# EAGLE design working (EAGLE 7.5.0)
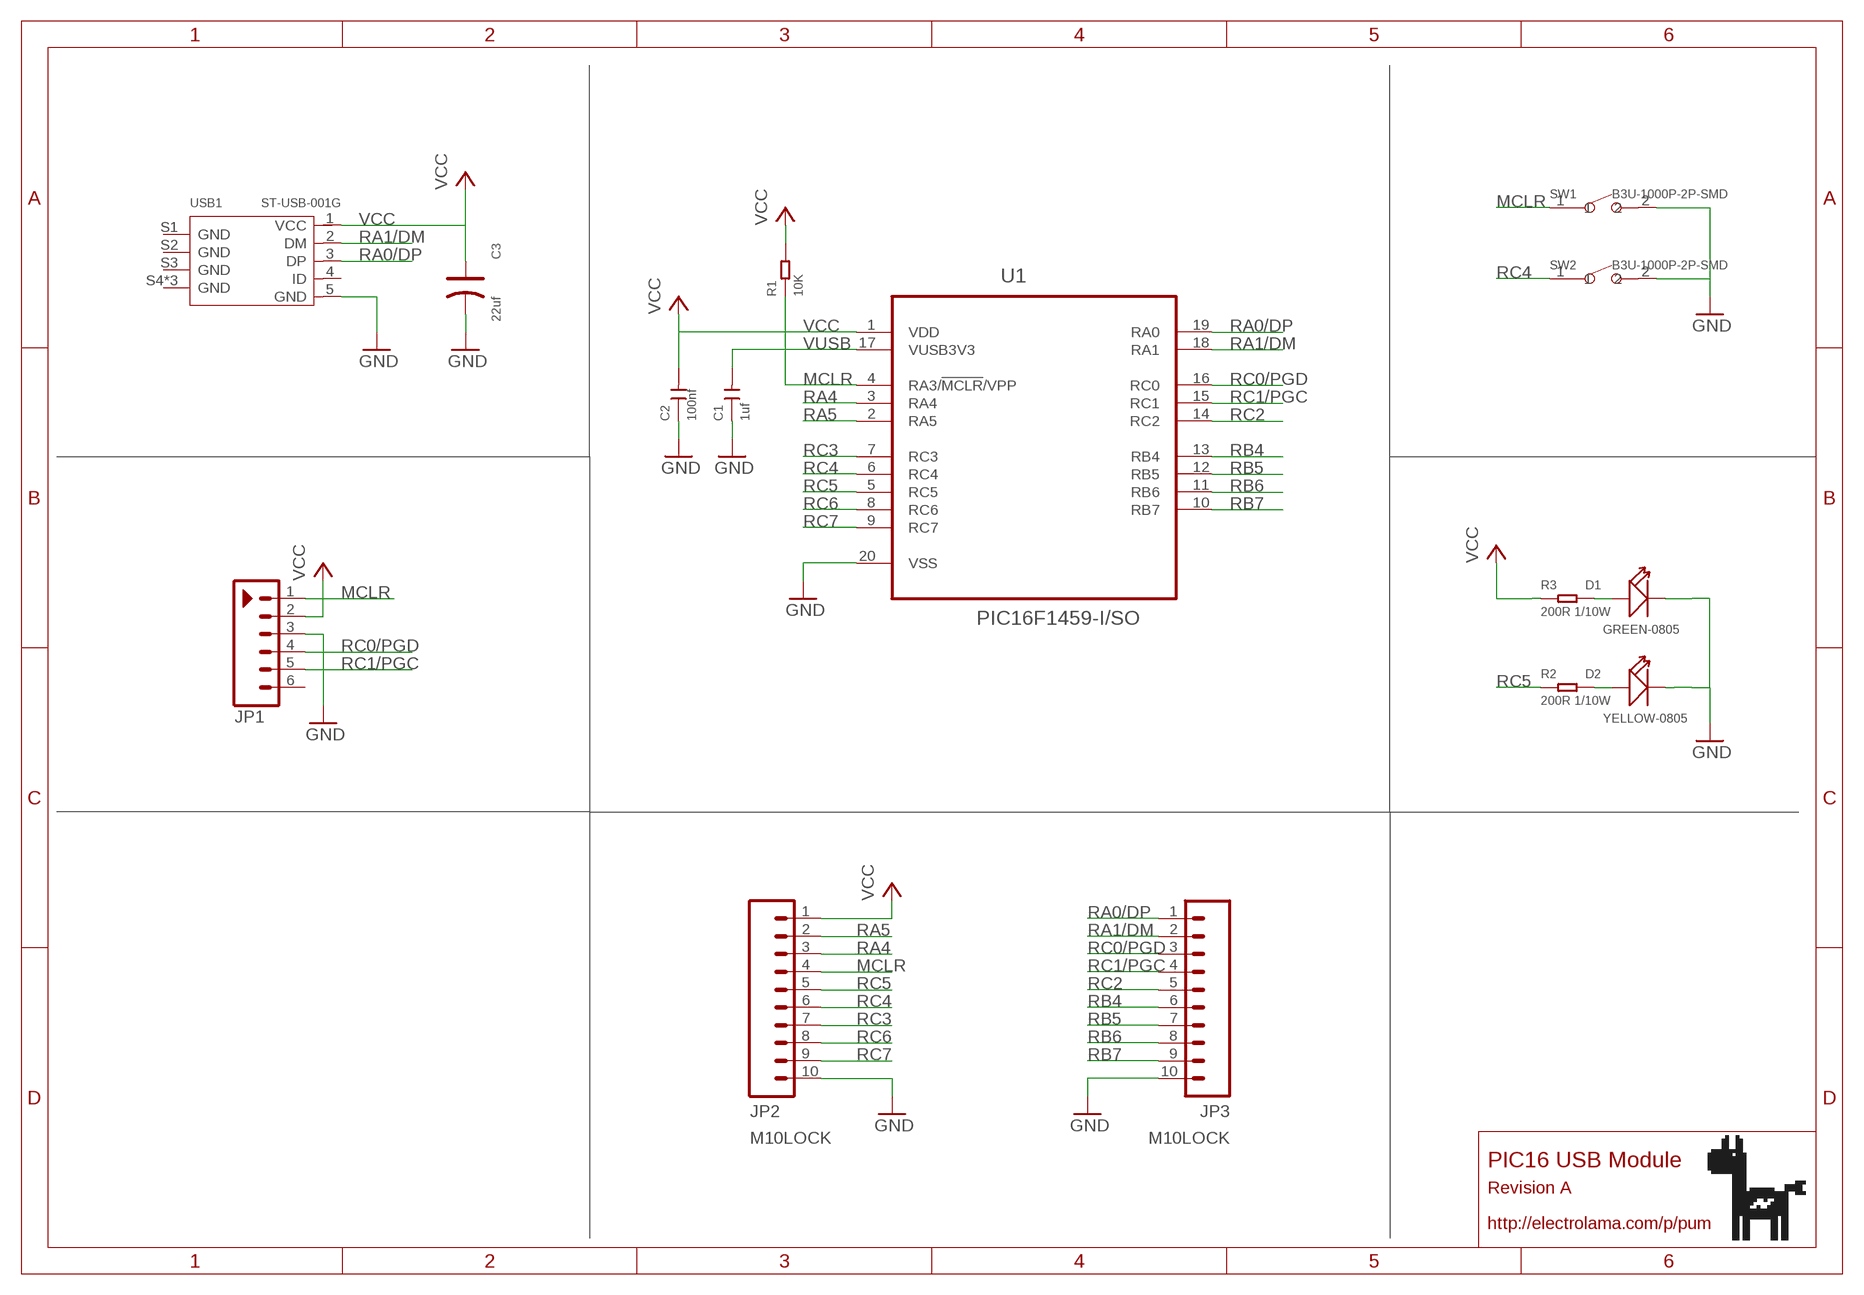
[diagram p0: schematic, sheet 1]

## Parts
C1  1uf  CERAMIC-1UF-25V-10%-X7R(0603)  [C0603]
C2  100nf  CERAMIC-100NF-50V-10%-X7R(0603)  [C0603]
C3  22uf  TANTALUM-SMD-22UF-16V(AVX-B)  [AVX-B]
D1  GREEN-0805  SMD-LED-CLEAR-GREEN(0805)  [LED-0805]
D2  YELLOW-0805  SMD-LED-CLEAR-YELLOW(0805)  [LED-0805]
JP1  M06LOCK  [1X06_LOCK]
JP2  M10LOCK  [1X10_LOCK]
JP3  M10LOCK  [1X10_LOCK]
R1  10K  SMD-RES-10K-1%-1/10W(0603)  [R0603]
R2  200R 1/10W  SMD-RES-200R-5%-1/10W(0603)  [R0603]
R3  200R 1/10W  SMD-RES-200R-5%-1/10W(0603)  [R0603]
SW1  B3U-1000P-2P-SMD  SMD-BUTTON(2P-3.0X2.5X1.2+0.4MM)-B3U-1000P-2P-SMD  [SW2-2.6-3.0X2.5X1.2+0.4MM]
SW2  B3U-1000P-2P-SMD  SMD-BUTTON(2P-3.0X2.5X1.2+0.4MM)-B3U-1000P-2P-SMD  [SW2-2.6-3.0X2.5X1.2+0.4MM]
U1  PIC16F1459-I/SO  [SOIC127P1030X265-20N]
USB1  ST-USB-001G  MICRO-USB-SMD-B-WITHOUT-POST-W/P(ST-USB-001G)  [MICRO-USB5+4P-SMD-0.65-B]

## Nets
GND: C1.1 C2.1 C3.- D1.- D2.- JP1.3 JP2.10 JP3.10 SW1.2 SW2.2 U1.20(VSS) USB1.5(GND)
MCLR: JP1.1 JP2.4 R1.1 SW1.1 U1.4(RA3/!MCLR!/VPP)
N$1: D2.+ R2.2
N$3: D1.+ R3.2
RA0/DP: JP3.1 U1.19(RA0) USB1.3(DP)
RA1/DM: JP3.2 U1.18(RA1) USB1.2(DM)
RA4: JP2.3 U1.3(RA4)
RA5: JP2.2 U1.2(RA5)
RB4: JP3.6 U1.13(RB4)
RB5: JP3.7 U1.12(RB5)
RB6: JP3.8 U1.11(RB6)
RB7: JP3.9 U1.10(RB7)
RC0/PGD: JP1.4 JP3.3 U1.16(RC0)
RC1/PGC: JP1.5 JP3.4 U1.15(RC1)
RC2: JP3.5 U1.14(RC2)
RC3: JP2.7 U1.7(RC3)
RC4: JP2.6 SW2.1 U1.6(RC4)
RC5: JP2.5 R2.1 U1.5(RC5)
RC6: JP2.8 U1.8(RC6)
RC7: JP2.9 U1.9(RC7)
VCC: C2.2 C3.+ JP1.2 JP2.1 R1.2 R3.1 U1.1(VDD) USB1.1(VCC)
VUSB: C1.2 U1.17(VUSB3V3)
Unconnected: JP1.6 USB1.4(ID) USB1.S1(GND) USB1.S2(GND) USB1.S3(GND) USB1.S4(GND) USB1.S5(GND) USB1.S6(GND)

## Notes on the sheet
- PIC16 USB Module
- Revision A
- http://electrolama.com/p/pum

## Library data of the parts
C1 = Seeed-Capacitor-2016:CERAMIC-1UF-25V-10%-X7R(0603): 302010139; MPN: CC0603KRX7R8BB105
C2 = Seeed-Capacitor-2016:CERAMIC-100NF-50V-10%-X7R(0603): 302010138; MPN: CC0603KRX7R9BB104
C3 = Seeed-Capacitor-2016:TANTALUM-SMD-22UF-16V(AVX-B): 302020013; MPN: TAJB226*016#NJ
D1 = Seeed-LED-2016:SMD-LED-CLEAR-GREEN(0805): 304090057; MPN: 17-215SYGC/S530-E2/TR8
D2 = Seeed-LED-2016:SMD-LED-CLEAR-YELLOW(0805): 304090039; MPN: 17-215UYC/S530-A3/TR8
JP1 = SparkFun-Connectors:M06: Header 6 Standard 6-pin 0.1" header. Use with straight break away headers (SKU : PRT-00116), right angle break away headers (PRT-00553), swiss pins (PRT-00743), machine pins (PRT-00117), and female headers (PRT-00115). Molex polarized connector foot print use with SKU : PRT-08094 with associated crimp pins and housings. NOTES ON THE VARIANTS LOCK and LOCK_LONGPADS... This footprint was designed to help hold the alignment of a through-hole component (i.e. 6-pin header) while soldering it into place. You may notice that each hole has been shifted either up or down by 0.005 of an inch from it's more standard position (which is a perfectly straight line). This slight alteration caused the pins (the squares in the middle) to touch the edges of the holes. Because they are alternating, it causes a "brace" to hold the component in place. 0.005 has proven to be the perfect amount of "off-center" position when using our standard breakaway headers. Although looks a little odd when you look at the bare footprint, once you have a header in there, the alteration is very hard to notice. Also,if you push a header all the way into place, it is covered up entirely on the bottom side. This idea of altering the position of holes to aid alignment will be further integrated into the Sparkfun Library for other footprints. It can help hold any component with 3 or more connection pins.
JP2 JP3 = SparkFun-Connectors:M10: Header 10 Standard 10-pin 0.1" header. Use with straight break away headers (SKU : PRT-00116), right angle break away headers (PRT-00553), swiss pins (PRT-00743), machine pins (PRT-00117), and female headers (PRT-00115).
R1 = Seeed-Resistor-2016:SMD-RES-10K-1%-1/10W(0603): 301010299; MPN: RC0603FR-0710KL
R2 R3 = Seeed-Resistor-2016:SMD-RES-200R-5%-1/10W(0603): 301010218; MPN: RC0603JR-07200RL
SW1 SW2 = Seeed-Switch-2016:SMD-BUTTON(2P-3.0X2.5X1.2+0.4MM): 311020047; MPN: B3U-1000P-2P-SMD
U1 = ok:PIC16F1459-I/SO: 8-Bit USB Microcontrollers,SOIC-20; MPN: PIC16F1459-I/SO; OC_FARNELL: 2305817; OC_NEWARK: 83T7220; PACKAGE: SOIC-20; SUPPLIER: MICROCHIP
USB1 = Seeed-Connector -2016:MICRO-USB-SMD-B-WITHOUT-POST-W/P(ST-USB-001G): 320010000; MPN: ST-USB-001G

## Board
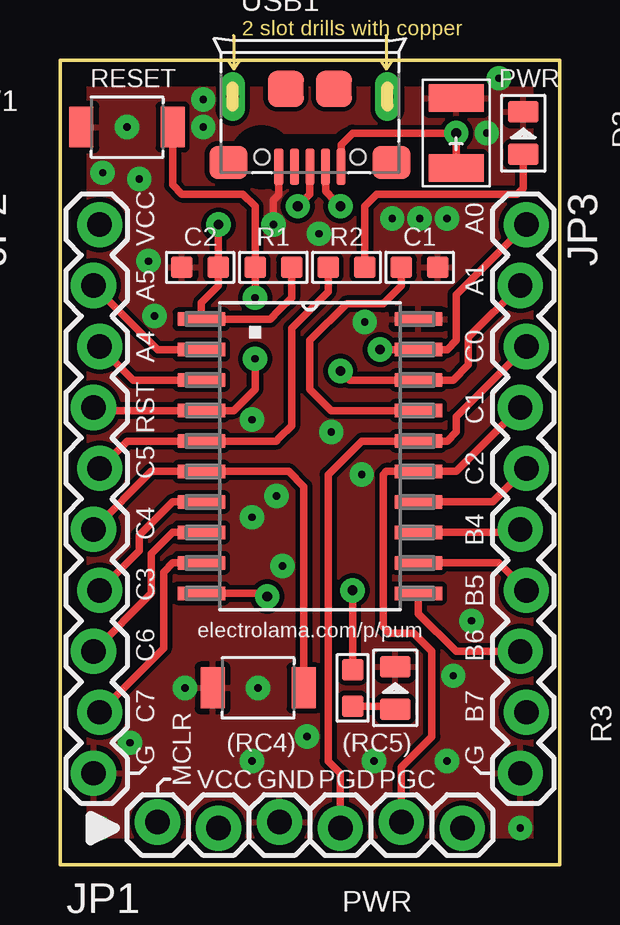
[diagram p1: board, top side]
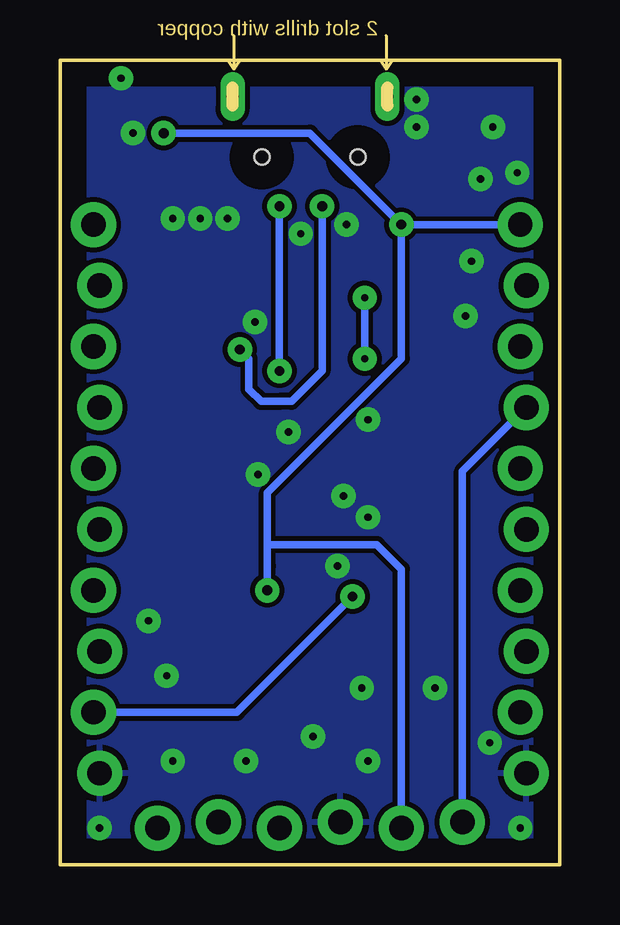
[diagram p2: board, bottom side, seen from below]

Size 20.83 x 33.53 mm. Coordinates in mm from the lower left corner, seen from the top.
Outline: 0,0 20.83,0 20.83,33.53 0,33.53 0,0
Copper layers (1*16): Top 0.035mm / dielectric 1.5mm / Bottom 0.035mm
Design rules "default": minimum track width 10mil, minimum drill 0.6mm, track to track 8mil, track to pad 8mil, pad to pad 8mil, via to via 8mil, smd to smd 8mil, copper to edge 40mil, drill to drill 8mil, minimum pad ring 10mil, minimum via ring 8mil, stop-mask expansion 4mil, vias tented up to drill 0mil, thermal gap 10mil

### Footprints (pad centres in the part's own frame; a part is rotated, then mirrored left to right if it is on the bottom)
C0603 = smd 0.889 x 0.889: 1 0,0.762; 2 0,-0.762
AVX-B = smd 1.143 x 2.286: + -1.46,0; - 1.46,0
LED-0805 = smd 0.889 x 1.27: + -0.889,0; - 0.889,0
1X06_LOCK = drill 1.016 pad 1.88: 1 0,0; 2 2.54,-0.254; 3 5.08,0; 4 7.62,-0.254; 5 10.16,0; 6 12.7,-0.254
1X10_LOCK = drill 1.016 pad 1.88: 1 0,0.127; 2 2.54,-0.127; 3 5.08,0.127; 4 7.62,-0.127; 5 10.16,0.127; 6 12.7,-0.127; 7 15.24,0.127; 8 17.78,-0.127; 9 20.32,0.127; 10 22.86,-0.127
R0603 = smd 0.889 x 0.889: 1 0,0.762; 2 0,-0.762
SW2-2.6-3.0X2.5X1.2+0.4MM = smd 1 x 1.7: 1 -1.9,0; 2 1.9,0
SOIC127P1030X265-20N = smd 1.981 x 0.559: 1 -4.521,5.715; 2 -4.521,4.445; 3 -4.521,3.175; 4 -4.521,1.905; 5 -4.521,0.635; 6 -4.521,-0.635; 7 -4.521,-1.905; 8 -4.521,-3.175; 9 -4.521,-4.445; 10 -4.521,-5.715; 11 4.521,-5.715; 12 4.521,-4.445; 13 4.521,-3.175; 14 4.521,-1.905; 15 4.521,-0.635; 16 4.521,0.635; 17 4.521,1.905; 18 4.521,3.175; 19 4.521,4.445; 20 4.521,5.715
MICRO-USB5+4P-SMD-0.65-B = smd 0.381 x 1.524: 1 -1.3,-0.25; 2 -0.65,-0.25; 3 0,-0.25; 4 0.65,-0.25; 5 1.3,-0.25 | smd 1.6 x 1.397: S1 -3.4,-0.427; S6 3.4,-0.427 | drill 0.508 pad 1.016 long: S2 -3.226,-3.175; S5 3.226,-3.175 | smd 1.5 x 1.5: S3 -1,-3.5; S4 1,-3.5 | hole 0.635: -2,-0.65; 2,-0.65

### Placement (x,y rotation side)
C1  14.99,24.89 270 top
C2  5.84,24.89 90 top
C3  16.51,30.48 90 top
D1  13.97,7.37 90 top
D2  19.3,30.48 90 top
JP1  4.06,1.78 0 top
JP2  1.52,26.67 270 top
JP3  19.3,26.67 270 top
R1  8.89,24.89 90 top
R2  11.94,24.89 90 top
R3  12.19,7.37 0 top
SW1  2.79,30.73 180 top
SW2  8.26,7.37 180 top
U1  10.41,17.02 0 top
USB1  10.41,28.83 180 top

### Tracks (layer width: path | path; a pad name or v marks a point on that pad's centre or on a via)
GND  (via drill 0.3 pad 1.02)
  Top 0.305: USB1.5 9.11,27.91 8.89,27.69 v8.89,26.67
  other vias: 1.78,28.83 17.78,30.48 16.13,26.92 12.7,22.61 13.84,26.92 3.3,28.57 9.02,15.37 11.3,18.03 12.57,16.26 9.27,12.45 17.14,10.16 16.38,7.87 16.13,4.32 13.08,4.32 10.29,5.33 8,4.32 5.21,7.37 2.92,5.08 19.18,1.52 3.94,22.86 3.68,25.15 5.97,31.88 18.29,32.77 8.26,7.37 1.65,1.52 2.79,30.73 14.99,26.92 10.79,26.29 8,18.54 8,14.48 5.97,30.73
  pour Bottom: 0,33.53 0,0 20.83,0 20.83,33.53
  pour Top: 0,33.53 0,0 20.83,0 20.83,33.53
MCLR  (via drill 0.3 pad 1.02)
  Top 0.305: SW1.1 4.69,28.33 5.08,27.94 7.62,27.94 8.13,27.43 R1.1 v8.13,23.62 | JP2.4 1.52,18.92 U1.4 7.24,18.92 8.13,19.81 v8.13,21.08
  Bottom 0.305: JP1.1 4.06,16.38 JP2.4 | v8.13,21.08 v8.13,23.62
N$1
  Top 0.305: D2.+ 19.3,28.19 19.05,27.94 13.21,27.94 12.7,27.43 R2.2
N$3
  Top 0.305: R3.2 13.84,6.6 D1.+
RA0/DP  (via drill 0.41 pad 1.02)
  Top 0.305: USB1.3 10.41,27.94 v9.91,27.43 | v13.34,21.46 U1.19 16.13,21.46 16.51,21.84 16.51,23.75 JP3.1
  Bottom 0.305: v13.34,21.46 12.95,21.08 12.95,19.81 12.45,19.3 11.68,19.3 11.18,19.3 9.91,20.57 v9.91,27.43
RA1/DM  (via drill 0.41 pad 1.02)
  Top 0.305: USB1.2 11.06,28.05 11.43,27.69 v11.68,27.43 | v11.68,20.57 12.06,20.19 U1.18 16.38,20.19 17.02,20.83 17.02,21.97 JP3.2
  Bottom 0.305: v11.68,27.43 11.68,21.08 | 11.68,21.08 v11.68,20.57 11.68,21.08
RA4
  Top 0.305: U1.3 3.05,20.19 JP2.3
RA5
  Top 0.305: U1.2 4.06,21.46 JP2.2
RB4
  Top 0.305: U1.13 19.05,13.84 JP3.6
RB5
  Top 0.305: U1.12 18.29,12.57 JP3.7
RB6
  Top 0.305: U1.11 14.94,10.46 16.51,8.89 JP3.8
RB7  (via drill 0.41 pad 1.02)
  Top 0.305: U1.10 8.51,11.3 v8.64,11.18
  Bottom 0.305: JP3.9 13.46,6.35 v8.64,11.18
RC0/PGD
  Top 0.305: JP3.3 16.51,18.67 16.51,18.03 16.13,17.65 U1.16 12.57,17.65 11.18,16.26 11.18,4.32 11.68,3.81 JP1.4
RC1/PGC
  Top 0.305: JP3.4 16.51,16.38 U1.15 13.59,16.38 13.46,16.26 13.46,9.91 13.72,9.65 14.73,9.65 15.49,8.89 15.49,5.33 14.22,4.06 JP1.5
RC2
  Top 0.305: U1.14 18.03,15.11 JP3.5
RC3
  Top 0.305: U1.7 4.7,15.11 3.3,13.72 3.3,13.08 JP2.7
RC4
  Top 0.305: SW2.1 10.16,15.75 9.53,16.38 U1.6 3.81,16.38 JP2.6
RC5
  Top 0.305: R2.1 11.18,23.88 9.65,22.35 9.65,18.29 9.14,17.78 9.02,17.65 U1.5 2.79,17.65 JP2.5
RC6
  Top 0.305: U1.8 4.7,13.84 3.81,12.95 3.81,11.3 JP2.8
RC7
  Top 0.305: U1.9 4.7,12.57 4.32,12.19 4.32,9.02 JP2.9
VCC  (via drill 0.41 pad 1.02)
  Top 0.305: v6.6,26.67 C2.2 6.6,24.13 6.35,23.88 6.1,23.62 5.89,23.42 U1.1 8.76,22.73 9.14,23.11 9.65,23.62 R1.2 | USB1.1 11.71,30 12.19,30.48 v16.51,30.48 C3.+ | R3.1 v12.19,11.43
  Bottom 0.305: v6.6,26.67 JP2.1 | v16.51,30.48 10.41,30.48 v6.6,26.67 | v12.19,11.43 12.19,12.45 12.19,13.34 | 12.19,13.34 12.19,15.49 6.6,21.08 v6.6,26.67 | JP1.2 6.6,12.32 7.62,13.34 12.19,13.34
VUSB
  Top 0.305: C1.2 14.22,24.13 13.46,23.37 11.94,23.37 10.41,21.84 10.41,19.81 11.3,18.92 U1.17

### Text on the board
tNames: RESET | PWR | VCC | A0 | A5 | A1 | A4 | C0 | RST | C1 | C5 | C2 | C4 | B4 | C3 | B5 | electrolama.com/p/pum | C6 | B6 | C7 | B7 | G | MCLR | (RC4) | (RC5) | G | VCC | GND | PGD | PGC | PWR